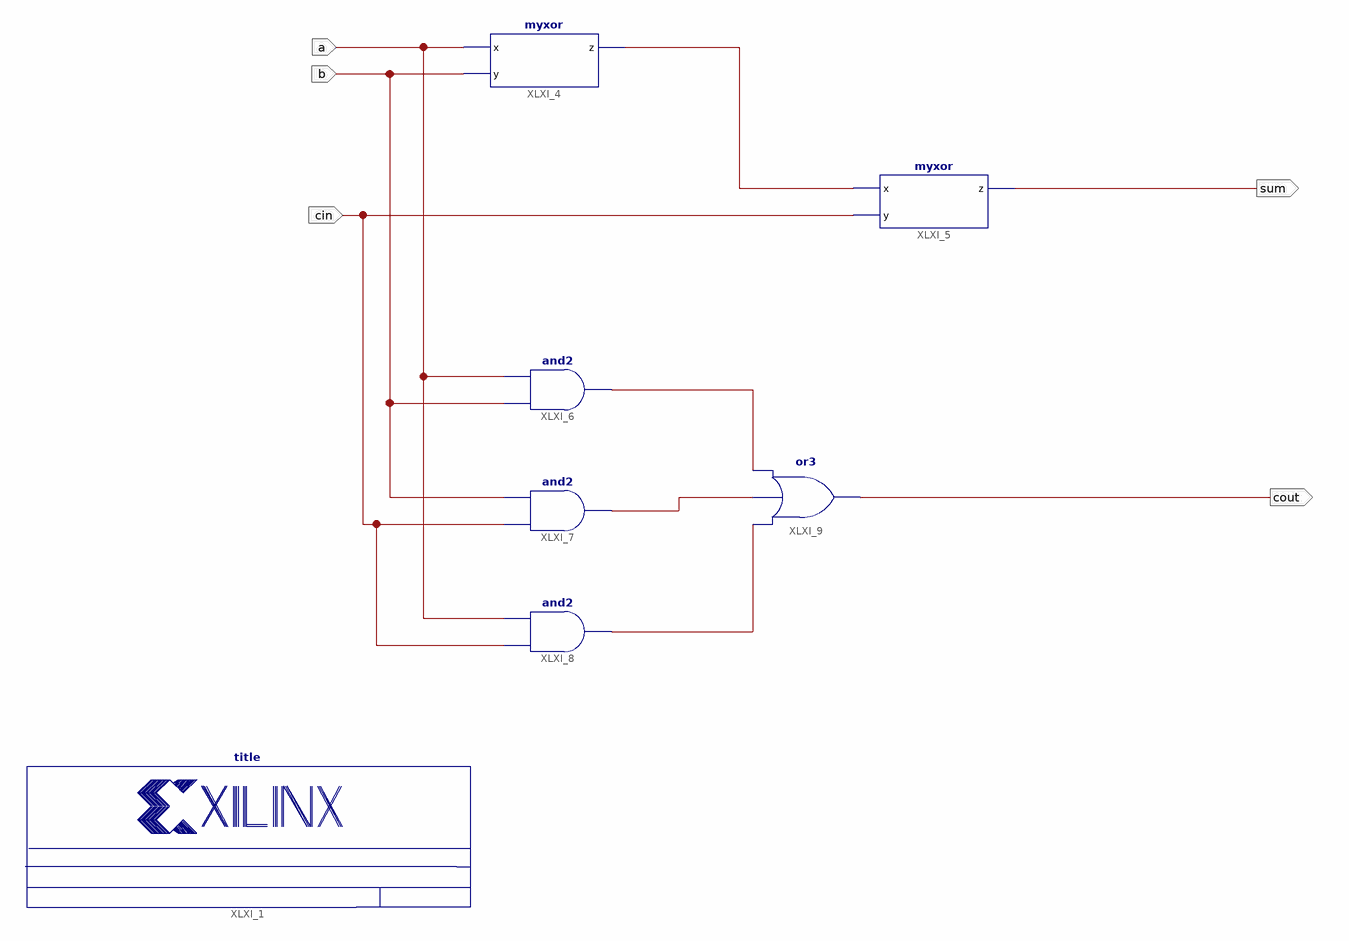
[diagram p0: schematic sheet 1]
// Xilinx ISE schematic fuller_adder_sch.sch (spartan3e) as structural Verilog: 7 symbols, 5 ports
module fuller_adder_sch (
  input  a,
  input  b,
  input  cin,
  output sum,
  output cout
);

  wire XLXN_5, XLXN_6, XLXN_7, XLXN_8;

  title #(.NameFieldText("Full adder")) XLXI_1 ();
  myxor XLXI_4 (.x(a), .y(b), .z(XLXN_5));
  myxor XLXI_5 (.x(XLXN_5), .y(cin), .z(sum));
  and XLXI_6 (XLXN_6, b, a);
  and XLXI_7 (XLXN_7, cin, b);
  and XLXI_8 (XLXN_8, cin, a);
  or XLXI_9 (cout, XLXN_8, XLXN_7, XLXN_6);
endmodule
